# EAGLE design FeatherGPS6 (EAGLE 9.6.2)
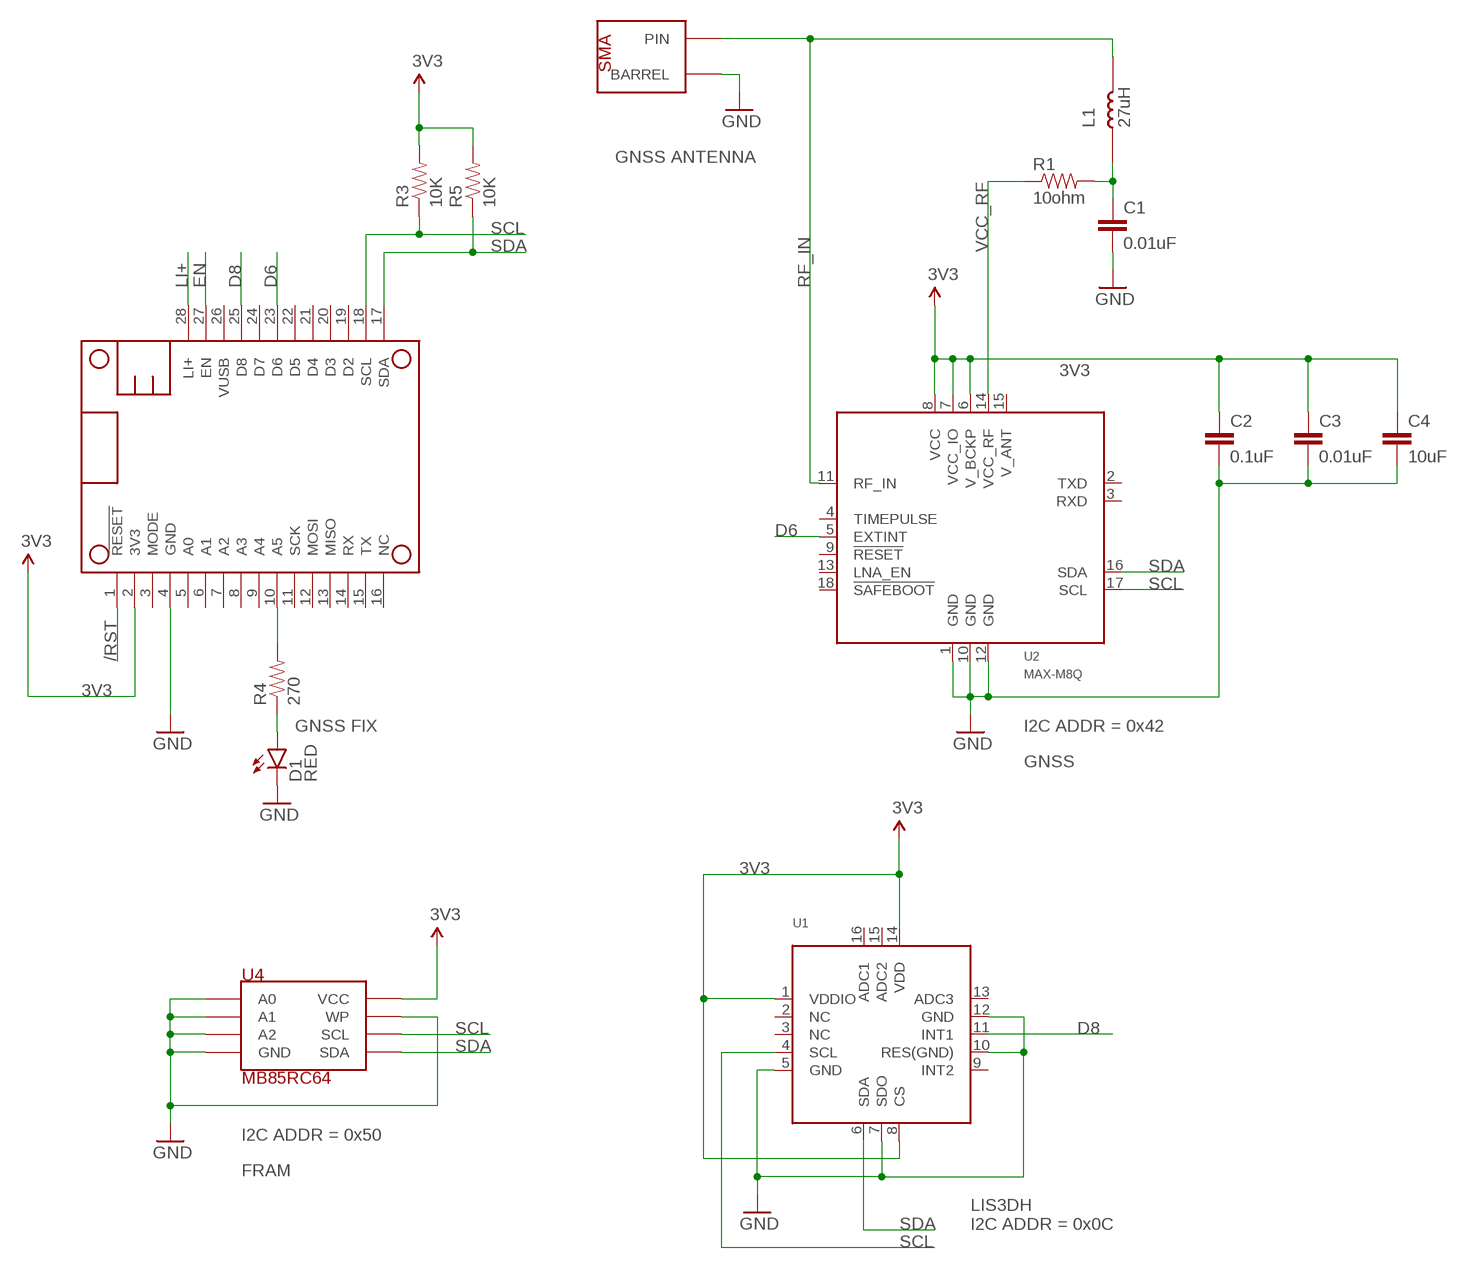
[diagram p0: schematic, sheet 1]

## Parts
C1  0.01uF  CAP-0.01UF-0603  [0603-CAP]
C2  0.1uF  CAP-0.1UF-0603  [0603-CAP]
C3  0.01uF  CAP-0.01UF-0603  [0603-CAP]
C4  10uF  CAP-10UF-0603  [0603-CAP]
D1  RED  LED-RED  [LED-0603]
J1  SMA  CONN-SMA  [CONN-SMA]
L1  27uH  INDUCTOR-27UH  [0805]
MS1  FEATHERWING_NODIM  [FEATHERWING_NODIM]
R1  10ohm  RES-10-06030603  [0603-RES]
R3  10K  RES-10K-06030603  [0603-RES]
R4  270  RES-270-0603.DEV  [0603-RES]
R5  10K  RES-10K-06030603  [0603-RES]
U1  LIS3DHTR  [MICROBUILDER_LGA16_3X3MM]
U2  MAX-M8Q  U-BLOX_MAX-M8  [U-BLOX_MAX-M8]
U4  MB85RC64  MB85RC64-FRAM  [8-SOIC-MAXIM]

## Nets
3V3: C2.1 C3.1 C4.1 MS1.2(3V3) R3.2 R5.2 U1.1(VDDIO) U1.8(CS) U1.14(VDD) U2.6(V_BCKP) U2.7(VCC_IO) U2.8(VCC) U4.8(VCC)
/RST: MS1.1(!RESET)
A5: MS1.10(A5) R4.2
D6: MS1.23(D6) U2.5(EXTINT)
D8: MS1.25(D8) U1.11(INT1)
EN: MS1.27(EN)
GND: C1.2 C2.2 C3.2 C4.2 D1.C J1.2(BARREL) J1.3(BARREL) J1.4(BARREL) J1.5(BARREL) MS1.4(GND) U1.5(GND) U1.7(SDO) U1.10(RES(GND)) U1.12(GND) U2.1(GND) U2.10(GND) U2.12(GND) U4.1(A0) U4.2(A1) U4.3(A2) U4.4(GND) U4.7(WP)
LI+: MS1.28(LI+)
N$3: C1.1 L1.1 R1.2
N$7: D1.A R4.1
RF_IN: J1.PIN L1.2 U2.11(RF_IN)
SCL: MS1.18(SCL) R3.1 U1.4(SCL) U2.17(SCL) U4.6(SCL)
SDA: MS1.17(SDA) R5.1 U1.6(SDA) U2.16(SDA) U4.5(SDA)
VCC_RF: R1.1 U2.14(VCC_RF)
Unconnected: MS1.3(MODE) MS1.5(A0) MS1.6(A1) MS1.7(A2) MS1.8(A3) MS1.9(A4) MS1.11(SCK) MS1.12(MOSI) MS1.13(MISO) MS1.14(RX) MS1.15(TX) MS1.16(NC) MS1.19(D2) MS1.20(D3) MS1.21(D4) MS1.22(D5) MS1.24(D7) MS1.26(VUSB) U1.2(NC) U1.3(NC) U1.9(INT2) U1.13(ADC3) U1.15(ADC2) U1.16(ADC1) U2.2(TXD) U2.3(RXD) U2.4(TIMEPULSE) U2.9(!RESET) U2.13(LNA_EN) U2.15(V_ANT) U2.18(!SAFEBOOT)

## Notes on the sheet
- GNSS ANTENNA
- GNSS FIX | I2C ADDR = 0x42
- GNSS
- I2C ADDR = 0x50
- FRAM
- LIS3DH
  I2C ADDR = 0x0C

## Library data of the parts
C1 C3 = rickk2:CAP-0.01UF-0603: CAP CER 10000PF 100V X7R 0603 10000 pF = 10 nF = 0.01 uF https://www.digikey.com/product-detail/en/murata-electronics-north-america/GCM188R72A103KA37J/490-8028-1-ND/4380313
C2 = rickk2:CAP-0.1UF-0603: CAP CER 0.1UF 16V X7R 0603 https://www.digikey.com/product-detail/en/murata-electronics-north-america/GRM188R71C104KA01D/490-1532-1-ND/587771
C4 = rickk2:CAP-10UF-0603: CAP CER 10UF 16V X5R 0805 $ 0.21 https://www.digikey.com/product-detail/en/murata-electronics-north-america/GRM21BR61C106KE15L/490-3886-1-ND/965928
D1 = rickk2:LED-RED: LED RED CLEAR 0603 SMD $0.41 Red 631nm LED Indication - Discrete 2V 0603 (1608 Metric) 5mA@2V https://www.digikey.com/product-detail/en/lite-on-inc/LTST-C193KRKT-5A/160-1830-1-ND/2356251 Res = 270 ohm @ 3.3V Res = 680 ohm 1/8W @ 5V Res = 2.2K 1/8W @ 12V
J1 = rickk2:CONN-SMA: TE Connectivity AMP Connectors 5-1814400-1 $2.82 CONN SMA JACK R/A 50 OHM PCB SMA Connector Jack, Female Socket 50 Ohm Through Hole, Right Angle Solder https://www.digikey.com/product-detail/en/te-connectivity-amp-connectors/5-1814400-1/A97593-ND/1755981
L1 = rickk2:INDUCTOR-27UH: TDK Corporation MLF2012C270KT000 FIXED IND 27UH 5MA 1 OHM SMD 27µH Shielded Multilayer Inductor 5mA 1 Ohm Max 0805 (2012 Metric) https://www.digikey.com/product-detail/en/tdk-corporation/MLF2012C270KT000/445-1064-1-ND/504462
MS1 = Particle-Mesh:FEATHERWING
R1 = rickk2:RES-10-0603: Panasonic Electronic Components ERJ-3GEYJ100V RES SMD 10 OHM 5% 1/10W 0603 10 Ohms ±5% 0.1W, 1/10W Chip Resistor 0603 (1608 Metric) Automotive AEC-Q200 Thick Film https://www.digikey.com/product-detail/en/panasonic-electronic-components/ERJ-3GEYJ100V/P10GCT-ND/62816; VALUE: 10
R3 R5 = rickk2:RES-10K-0603: RES SMD 10K OHM 5% 1/4W 0603 $ 0.10 https://www.digikey.com/product-detail/en/panasonic-electronic-components/ERJ-PA3J103V/P10KBZCT-ND/5036237
R4 = rickk2:RES-270-0603.DEV: RES SMD 270 OHM 5% 1/10W 0603 $0.10 Panasonic ERJ-3GEYJ271V ±5% 0.1W, 1/10W Chip Resistor 0603 (1608 Metric) Automotive AEC-Q200 Thick Film https://www.digikey.com/product-detail/en/panasonic-electronic-components/ERJ-3GEYJ271V/P270GCT-ND/134766
U1 = rickk2:LIS3DHTR: LIS3DHTR 3-Axis Accelerometer with I2C/SPI Interface VDD: 1.71-3.6V VDDIO: 1.71-VDD+0.1V Scale: +/-2g, 4g, 8g, 16g with 16--bit data output Temp:: -40°C - 85°C Mouser: 511-LIS3DHTR Digikey: 497-10613-1-ND
U2 = rickk2:U-BLOX_MAX-M8: MAX-M8Q-0 $ 21.00 U-Blox America Inc. MAX-M8Q-0 RF RCVR GNSS/GPS 1.575GHZ 18LCC https://www.digikey.com/product-detail/en/u-blox-america-inc/MAX-M8Q-0/672-1003-1-ND/6150666
U4 = rickk2:MB85RC64-FRAM: Fujitsu MB85RC64TAPNF-G-BDERE1 IC FRAM 64K I2C 3.4MHZ 8SOP $ 1.58 FRAM (Ferroelectric RAM) Memory IC 64Kb (8K x 8) I²C 3.4MHz 8-SOP https://www.digikey.com/product-detail/en/fujitsu-electronics-america-inc/MB85RC64TAPNF-G-BDERE1/865-1274-1-ND/6802280

## Board
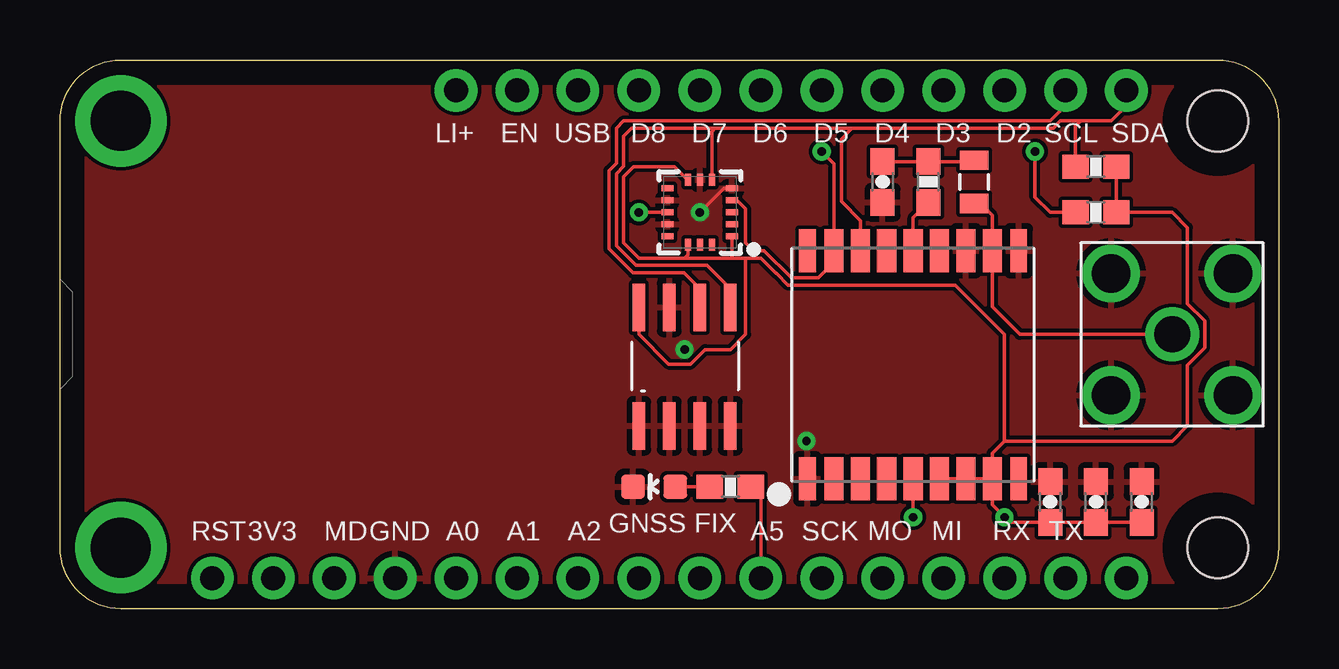
[diagram p1: board, top side]
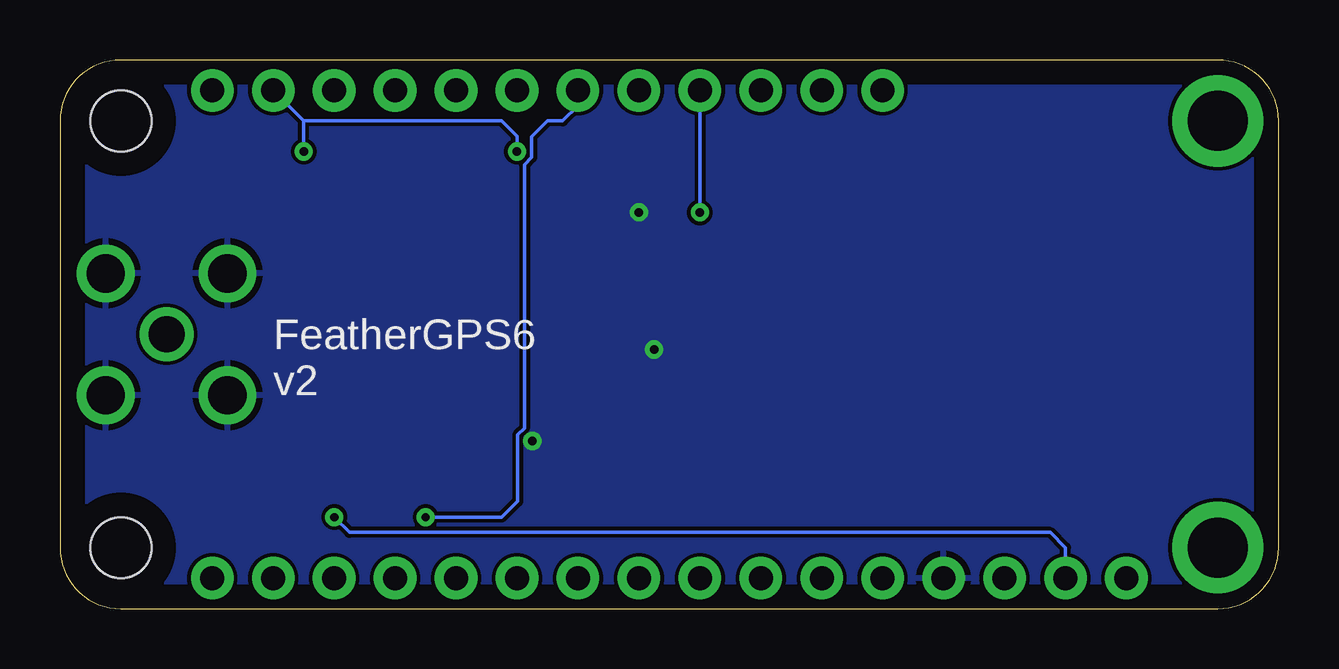
[diagram p2: board, bottom side, seen from below]

Size 50.8 x 22.86 mm. Coordinates in mm from the lower left corner, seen from the top.
Outline: 2.54,22.86 48.26,22.86 arc-90 50.8,20.32 50.8,2.54 arc-90 48.26,0 2.54,0 arc-90 0,2.54 0,20.32 arc-90 2.54,22.86
Copper layers (1*16): Top 0.035mm / dielectric 1.5mm / Bottom 0.035mm
Design rules "default": minimum track width 6mil, minimum drill 0.35mm, track to track 6mil, track to pad 6mil, pad to pad 6mil, via to via 6mil, smd to smd 6mil, copper to edge 40mil, drill to drill 6mil, minimum pad ring 10mil, minimum via ring 8mil, stop-mask expansion 4mil, vias tented up to drill 0mil, thermal gap 10mil

### Footprints (pad centres in the part's own frame; a part is rotated, then mirrored left to right if it is on the bottom)
0603-CAP = smd 1.1 x 1: 1 -0.85,0; 2 0.85,0
LED-0603 = smd 1 x 1: A 0,-0.877; C 0,0.877
CONN-SMA = drill 1.6: 2 -2.54,-2.54; 3 2.54,-2.54; 4 2.54,2.54; 5 -2.54,2.54 | drill 1.5: PIN 0,0
0805 = smd 0.8 x 1.2: 1 -0.9,0; 2 0.9,0
FEATHERWING_NODIM = drill 1 pad 1.778: 1 6.35,1.27; 2 8.89,1.27; 3 11.43,1.27; 4 13.97,1.27; 5 16.51,1.27; 6 19.05,1.27; 7 21.59,1.27; 8 24.13,1.27; 9 26.67,1.27; 10 29.21,1.27; 11 31.75,1.27; 12 34.29,1.27; 13 36.83,1.27; 14 39.37,1.27; 15 41.91,1.27; 16 44.45,1.27; 17 44.45,21.59; 18 41.91,21.59; 19 39.37,21.59; 20 36.83,21.59; 21 34.29,21.59; 22 31.75,21.59; 23 29.21,21.59; 24 26.67,21.59; 25 24.13,21.59; 26 21.59,21.59; 27 19.05,21.59; 28 16.51,21.59 | drill 2.5 pad 3.81: P$1 2.54,20.32; P$2 2.54,2.54 | hole 2.54: 48.26,20.32; 48.26,2.54
0603-RES = smd 1.1 x 1: 1 -0.85,0; 2 0.85,0
MICROBUILDER_LGA16_3X3MM = smd 0.5 x 0.25: 1 -1.35,1; 2 -1.35,0.5; 3 -1.35,0; 4 -1.35,-0.5; 5 -1.35,-1; 9 1.35,-1; 10 1.35,-0.5; 11 1.35,0; 12 1.35,0.5; 13 1.35,1 | smd 0.25 x 0.5: 6 -0.5,-1.35; 7 0,-1.35; 8 0.5,-1.35; 14 0.5,1.35; 15 0,1.35; 16 -0.5,1.35
U-BLOX_MAX-M8 = smd 1.8 x 0.7: 1 4.75,-4.4; 9 4.75,4.4; 10 -4.75,4.4; 18 -4.75,-4.4 | smd 1.8 x 0.8: 2 4.75,-3.3; 3 4.75,-2.2; 4 4.75,-1.1; 5 4.75,0; 6 4.75,1.1; 7 4.75,2.2; 8 4.75,3.3; 11 -4.75,3.3; 12 -4.75,2.2; 13 -4.75,1.1; 14 -4.75,0; 15 -4.75,-1.1; 16 -4.75,-2.2; 17 -4.75,-3.3
8-SOIC-MAXIM = smd 0.53 x 1.98: 1 0,0; 2 1.27,0; 3 2.54,0; 4 3.81,0; 5 3.81,4.93; 6 2.54,4.93; 7 1.27,4.93; 8 0,4.93

### Placement (x,y rotation side)
C1  34.29,17.78 270 top
C2  41.27,4.45 90 top
C3  43.18,4.45 90 top
C4  45.09,4.45 90 top
D1  24.77,5.08 90 top
J1  46.35,11.43 0 top
L1  38.1,17.78 270 top
MS1  0,0 0 top
R1  36.2,17.78 90 top
R3  43.18,16.51 0 top
R4  27.94,5.08 0 top
R5  43.18,18.41 0 top
U1  26.67,16.51 180 top
U2  35.56,10.16 270 top
U4  24.13,7.62 0 top

### Tracks (layer width: path | path; a pad name or v marks a point on that pad's centre or on a via)
3V3  (via drill 0.35)
  Top 0.152: U2.8 38.86,5.08 38.53,5.41 U2.7 U2.6 | C4.1 C3.1 C2.1 39.59,3.6 v39.37,3.81 38.86,4.32 U2.8 | R5.2 R3.2 46.35,16.51 46.99,15.88 46.99,12.71 47.71,11.99 47.71,10.87 46.99,10.15 46.99,7.62 46.35,6.99 39.37,6.99 | U2.8 38.86,6.47 39.37,6.99 | U1.8 25.61,18.41 23.91,18.41 23.5,18 23.5,15.24 24.13,14.61 26.04,14.61 | 26.04,14.61 26.17,14.74 U1.14 | 26.04,14.61 27.94,14.61 | 27.94,14.61 28.02,14.69 U1.1 | 39.37,6.99 39.37,11.43 37.32,13.48 30.35,13.48 29.86,13.97 29.84,13.97 29.21,14.61 28.57,14.61 | U4.8 24.13,11.43 25.37,10.19 26.29,10.19 26.89,10.79 27.94,10.79 28.57,11.43 28.57,14.61 | 28.57,14.61 27.94,14.61
  Bottom 0.152: MS1.2 8.89,2.54 9.53,3.17 38.73,3.17 v39.37,3.81
A5
  Top 0.152: R4.2 29.21,4.66 MS1.10
D6  (via drill 0.35)
  Top 0.152: U2.5 v35.56,3.81
  Bottom 0.152: v35.56,3.81 32.38,3.81 31.72,4.47 31.72,7.24 31.45,7.51 31.45,18.5 31.14,18.8 31.14,19.66 30.48,20.32 29.84,20.32 29.21,20.95 MS1.23
D8  (via drill 0.35)
  Top 0.152: v24.13,16.51 U1.11
  Bottom 0.152: MS1.25 v24.13,16.51
GND  (via drill 0.35)
  Top 0.152: U1.5 27.67,17.51 v26.67,16.51
  other vias: 31.11,6.99 26.04,10.79
  pour Top: 0,0 0,25.4 53.34,25.4 53.34,0
  pour Bottom: 0,0 0,27.94 50.8,27.94 50.8,0
N$3
  Top 0.152: C1.1 R1.2 38.05,18.63 L1.1
N$7
  Top 0.152: D1.A R4.1
RF_IN
  Top 0.152: J1.PIN 40.01,11.43 38.86,12.57 U2.11 38.86,16.39 38.37,16.88 L1.2
SCL  (via drill 0.35)
  Top 0.152: MS1.18 41.91,20.95 41.27,20.32 23.5,20.32 23.19,20.02 23.19,18.56 22.89,18.26 22.89,14.99 23.88,13.99 26.01,13.99 26.67,13.34 U4.6 | R3.1 41.27,16.51 40.64,17.14 v40.64,19.05 | v31.75,19.05 32.26,18.54 U2.17 32.26,14.44 31.61,13.78 30.48,13.78 29.35,14.91 28.91,14.91 28.57,15.24 28.57,16.65 28.22,17.01 U1.4
  Bottom 0.152: v40.64,19.05 40.64,20.32 | 40.64,20.32 MS1.18 | v31.75,19.05 31.75,19.68 32.38,20.32 40.64,20.32
SDA
  Top 0.152: MS1.17 44.45,20.95 43.81,20.32 42.55,20.32 | U2.16 33.36,16.17 32.56,16.96 32.56,19.56 33.02,20.02 | 27.3,20.02 24.13,20.02 23.82,20.02 23.5,19.68 23.5,18.43 23.19,18.13 23.19,15.11 24,14.3 26.98,14.3 27.94,13.34 U4.5 | 27.3,20.02 33.02,20.02 | 33.02,20.02 41.4,20.02 41.71,20.32 42.55,20.32 | 42.55,20.32 42.33,20.11 R5.1 | U1.6 27.17,19.88 27.3,20.02
VCC_RF
  Top 0.152: U2.14 35.56,16.3 R1.1

### Text on the board
tPlace: LI+ | EN | USB | D8 | D7 | D6 | D5 | D4 | D3 | D2 | SCL | SDA | RST | 3V3 | MD | GND | A0 | A1 | A2 | GNSS FIX | A5 | SCK | MO | MI | RX | TX
bPlace: FeatherGPS6 / v2